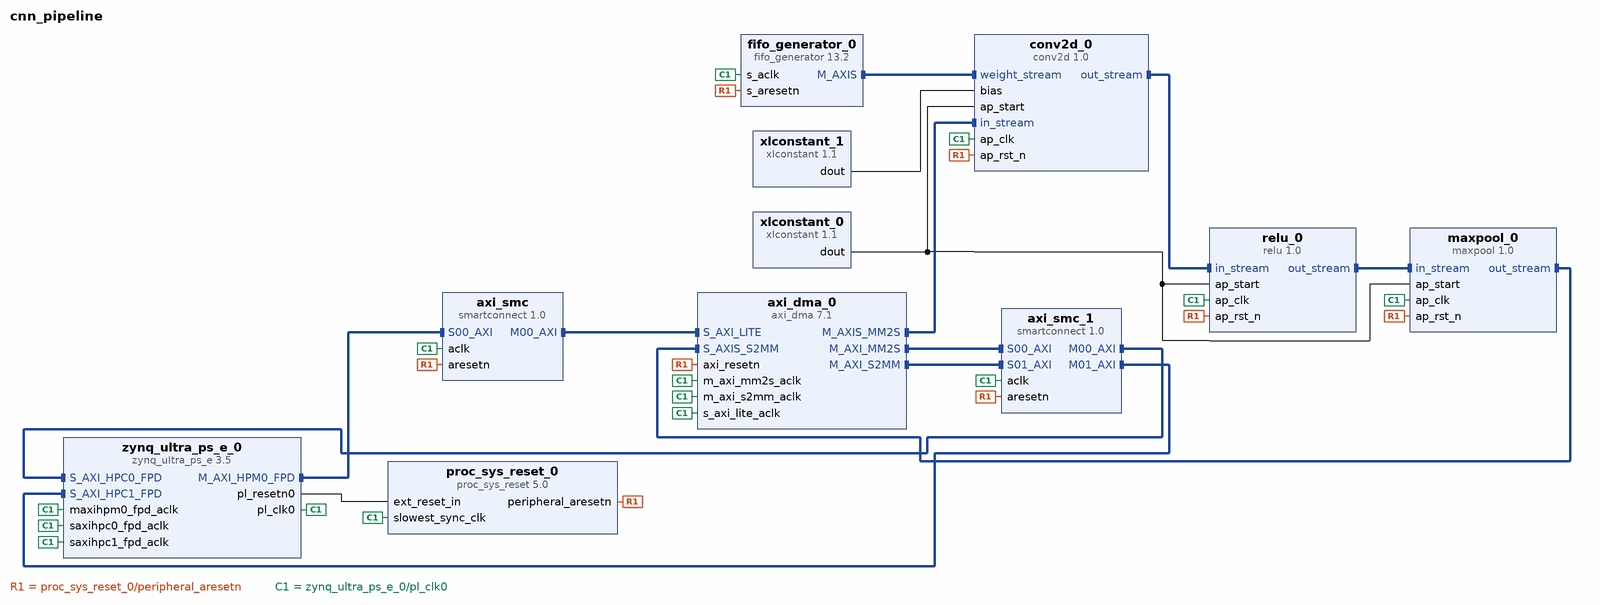
[diagram p0: block diagram of the top level]
# Vivado block design cnn_pipeline, xck26-sfvc784-2LV-c, Vivado 2025.2
create_bd_design cnn_pipeline

create_bd_cell -type ip -vlnv xilinx.com:ip:zynq_ultra_ps_e:3.5 zynq_ultra_ps_e_0
set_property -dict [list \
  CONFIG.PSU_BANK_0_IO_STANDARD LVCMOS18 \
  CONFIG.PSU_BANK_1_IO_STANDARD LVCMOS18 \
  CONFIG.PSU_BANK_2_IO_STANDARD LVCMOS18 \
  CONFIG.PSU_BANK_3_IO_STANDARD LVCMOS18 \
  CONFIG.PSU__CAN1__PERIPHERAL__ENABLE 0 \
  CONFIG.PSU__CRF_APB__ACPU_CTRL__FREQMHZ 1333.333 \
  CONFIG.PSU__CRF_APB__ACPU_CTRL__SRCSEL APLL \
  CONFIG.PSU__CRF_APB__APLL_CTRL__SRCSEL PSS_REF_CLK \
  CONFIG.PSU__CRF_APB__APLL_FRAC_CFG__ENABLED 1 \
  CONFIG.PSU__CRF_APB__DBG_FPD_CTRL__FREQMHZ 250 \
  CONFIG.PSU__CRF_APB__DBG_FPD_CTRL__SRCSEL IOPLL \
  CONFIG.PSU__CRF_APB__DBG_TRACE_CTRL__FREQMHZ 250 \
  CONFIG.PSU__CRF_APB__DBG_TRACE_CTRL__SRCSEL IOPLL \
  CONFIG.PSU__CRF_APB__DBG_TSTMP_CTRL__FREQMHZ 250 \
  CONFIG.PSU__CRF_APB__DBG_TSTMP_CTRL__SRCSEL IOPLL \
  CONFIG.PSU__CRF_APB__DDR_CTRL__FREQMHZ 1200 \
  CONFIG.PSU__CRF_APB__DDR_CTRL__SRCSEL DPLL \
  CONFIG.PSU__CRF_APB__DPDMA_REF_CTRL__FREQMHZ 600 \
  CONFIG.PSU__CRF_APB__DPDMA_REF_CTRL__SRCSEL APLL \
  CONFIG.PSU__CRF_APB__DPLL_CTRL__SRCSEL PSS_REF_CLK \
  CONFIG.PSU__CRF_APB__GDMA_REF_CTRL__FREQMHZ 600 \
  CONFIG.PSU__CRF_APB__GDMA_REF_CTRL__SRCSEL DPLL \
  CONFIG.PSU__CRF_APB__GPU_REF_CTRL__FREQMHZ 600 \
  CONFIG.PSU__CRF_APB__GPU_REF_CTRL__SRCSEL IOPLL \
  CONFIG.PSU__CRF_APB__TOPSW_LSBUS_CTRL__FREQMHZ 100 \
  CONFIG.PSU__CRF_APB__TOPSW_LSBUS_CTRL__SRCSEL IOPLL \
  CONFIG.PSU__CRF_APB__TOPSW_MAIN_CTRL__FREQMHZ 533.33 \
  CONFIG.PSU__CRF_APB__TOPSW_MAIN_CTRL__SRCSEL DPLL \
  CONFIG.PSU__CRF_APB__VPLL_CTRL__SRCSEL PSS_REF_CLK \
  CONFIG.PSU__CRL_APB__ADMA_REF_CTRL__FREQMHZ 500 \
  CONFIG.PSU__CRL_APB__ADMA_REF_CTRL__SRCSEL IOPLL \
  CONFIG.PSU__CRL_APB__CAN1_REF_CTRL__SRCSEL IOPLL \
  CONFIG.PSU__CRL_APB__CPU_R5_CTRL__FREQMHZ 533.333 \
  CONFIG.PSU__CRL_APB__CPU_R5_CTRL__SRCSEL RPLL \
  CONFIG.PSU__CRL_APB__DBG_LPD_CTRL__FREQMHZ 250 \
  CONFIG.PSU__CRL_APB__DBG_LPD_CTRL__SRCSEL IOPLL \
  CONFIG.PSU__CRL_APB__I2C1_REF_CTRL__FREQMHZ 100 \
  CONFIG.PSU__CRL_APB__I2C1_REF_CTRL__SRCSEL IOPLL \
  CONFIG.PSU__CRL_APB__IOPLL_CTRL__SRCSEL PSS_REF_CLK \
  CONFIG.PSU__CRL_APB__IOU_SWITCH_CTRL__FREQMHZ 250 \
  CONFIG.PSU__CRL_APB__IOU_SWITCH_CTRL__SRCSEL IOPLL \
  CONFIG.PSU__CRL_APB__LPD_LSBUS_CTRL__FREQMHZ 100 \
  CONFIG.PSU__CRL_APB__LPD_LSBUS_CTRL__SRCSEL IOPLL \
  CONFIG.PSU__CRL_APB__LPD_SWITCH_CTRL__FREQMHZ 500 \
  CONFIG.PSU__CRL_APB__LPD_SWITCH_CTRL__SRCSEL IOPLL \
  CONFIG.PSU__CRL_APB__PCAP_CTRL__FREQMHZ 200 \
  CONFIG.PSU__CRL_APB__PCAP_CTRL__SRCSEL IOPLL \
  CONFIG.PSU__CRL_APB__PL0_REF_CTRL__FREQMHZ 200 \
  CONFIG.PSU__CRL_APB__PL0_REF_CTRL__SRCSEL IOPLL \
  CONFIG.PSU__CRL_APB__PL1_REF_CTRL__SRCSEL IOPLL \
  CONFIG.PSU__CRL_APB__QSPI_REF_CTRL__FREQMHZ 125 \
  CONFIG.PSU__CRL_APB__QSPI_REF_CTRL__SRCSEL IOPLL \
  CONFIG.PSU__CRL_APB__RPLL_CTRL__SRCSEL PSS_REF_CLK \
  CONFIG.PSU__CRL_APB__SPI1_REF_CTRL__SRCSEL IOPLL \
  CONFIG.PSU__CRL_APB__TIMESTAMP_REF_CTRL__FREQMHZ 100 \
  CONFIG.PSU__CRL_APB__TIMESTAMP_REF_CTRL__SRCSEL IOPLL \
  CONFIG.PSU__CSUPMU__PERIPHERAL__VALID 1 \
  CONFIG.PSU__DDRC__BUS_WIDTH {64 Bit} \
  CONFIG.PSU__DDRC__COMPONENTS Components \
  CONFIG.PSU__DDRC__DEVICE_CAPACITY {8192 MBits} \
  CONFIG.PSU__DDRC__DRAM_WIDTH {16 Bits} \
  CONFIG.PSU__DDRC__ECC Disabled \
  CONFIG.PSU__DDRC__MEMORY_TYPE {DDR 4} \
  CONFIG.PSU__DDRC__SPEED_BIN DDR4_2400R \
  CONFIG.PSU__DDR_HIGH_ADDRESS_GUI_ENABLE 1 \
  CONFIG.PSU__DDR__INTERFACE__FREQMHZ 600.000 \
  CONFIG.PSU__FPGA_PL0_ENABLE 1 \
  CONFIG.PSU__FPGA_PL1_ENABLE 1 \
  CONFIG.PSU__GPIO0_MIO__IO {MIO 0 .. 25} \
  CONFIG.PSU__GPIO0_MIO__PERIPHERAL__ENABLE 1 \
  CONFIG.PSU__GPIO1_MIO__IO {MIO 26 .. 51} \
  CONFIG.PSU__GPIO1_MIO__PERIPHERAL__ENABLE 1 \
  CONFIG.PSU__I2C0__PERIPHERAL__ENABLE 0 \
  CONFIG.PSU__I2C1__PERIPHERAL__ENABLE 1 \
  CONFIG.PSU__I2C1__PERIPHERAL__IO {MIO 24 .. 25} \
  CONFIG.PSU__IOU_SLCR__IOU_TTC_APB_CLK__TTC0_SEL APB \
  CONFIG.PSU__IOU_SLCR__IOU_TTC_APB_CLK__TTC1_SEL APB \
  CONFIG.PSU__IOU_SLCR__IOU_TTC_APB_CLK__TTC2_SEL APB \
  CONFIG.PSU__IOU_SLCR__IOU_TTC_APB_CLK__TTC3_SEL APB \
  CONFIG.PSU__MAXIGP0__DATA_WIDTH 128 \
  CONFIG.PSU__OVERRIDE__BASIC_CLOCK 0 \
  CONFIG.PSU__PMU_COHERENCY 0 \
  CONFIG.PSU__PMU__AIBACK__ENABLE 0 \
  CONFIG.PSU__PMU__EMIO_GPI__ENABLE 0 \
  CONFIG.PSU__PMU__EMIO_GPO__ENABLE 0 \
  CONFIG.PSU__PMU__GPI0__ENABLE 1 \
  CONFIG.PSU__PMU__GPI0__IO {MIO 26} \
  CONFIG.PSU__PMU__GPI1__ENABLE 0 \
  CONFIG.PSU__PMU__GPI2__ENABLE 0 \
  CONFIG.PSU__PMU__GPI3__ENABLE 0 \
  CONFIG.PSU__PMU__GPI4__ENABLE 0 \
  CONFIG.PSU__PMU__GPI5__ENABLE 1 \
  CONFIG.PSU__PMU__GPI5__IO {MIO 31} \
  CONFIG.PSU__PMU__GPO0__ENABLE 0 \
  CONFIG.PSU__PMU__GPO1__ENABLE 0 \
  CONFIG.PSU__PMU__GPO2__ENABLE 0 \
  CONFIG.PSU__PMU__GPO3__ENABLE 1 \
  CONFIG.PSU__PMU__GPO3__IO {MIO 35} \
  CONFIG.PSU__PMU__GPO3__POLARITY low \
  CONFIG.PSU__PMU__GPO4__ENABLE 0 \
  CONFIG.PSU__PMU__GPO5__ENABLE 0 \
  CONFIG.PSU__PMU__PERIPHERAL__ENABLE 1 \
  CONFIG.PSU__PMU__PLERROR__ENABLE 0 \
  CONFIG.PSU__PRESET_APPLIED 1 \
  CONFIG.PSU__PSS_REF_CLK__FREQMHZ 33.333 \
  CONFIG.PSU__QSPI_COHERENCY 0 \
  CONFIG.PSU__QSPI_ROUTE_THROUGH_FPD 0 \
  CONFIG.PSU__QSPI__GRP_FBCLK__ENABLE 0 \
  CONFIG.PSU__QSPI__PERIPHERAL__DATA_MODE x4 \
  CONFIG.PSU__QSPI__PERIPHERAL__ENABLE 1 \
  CONFIG.PSU__QSPI__PERIPHERAL__IO {MIO 0 .. 5} \
  CONFIG.PSU__QSPI__PERIPHERAL__MODE Single \
  CONFIG.PSU__SPI1__GRP_SS0__IO {MIO 9} \
  CONFIG.PSU__SPI1__PERIPHERAL__ENABLE 1 \
  CONFIG.PSU__SPI1__PERIPHERAL__IO {MIO 6 .. 11} \
  CONFIG.PSU__SWDT0__CLOCK__ENABLE 0 \
  CONFIG.PSU__SWDT0__PERIPHERAL__ENABLE 1 \
  CONFIG.PSU__SWDT0__RESET__ENABLE 0 \
  CONFIG.PSU__SWDT1__CLOCK__ENABLE 0 \
  CONFIG.PSU__SWDT1__PERIPHERAL__ENABLE 1 \
  CONFIG.PSU__SWDT1__RESET__ENABLE 0 \
  CONFIG.PSU__TTC0__CLOCK__ENABLE 0 \
  CONFIG.PSU__TTC0__PERIPHERAL__ENABLE 1 \
  CONFIG.PSU__TTC0__WAVEOUT__ENABLE 0 \
  CONFIG.PSU__TTC1__CLOCK__ENABLE 0 \
  CONFIG.PSU__TTC1__PERIPHERAL__ENABLE 1 \
  CONFIG.PSU__TTC1__WAVEOUT__ENABLE 0 \
  CONFIG.PSU__TTC2__CLOCK__ENABLE 0 \
  CONFIG.PSU__TTC2__PERIPHERAL__ENABLE 1 \
  CONFIG.PSU__TTC2__WAVEOUT__ENABLE 0 \
  CONFIG.PSU__TTC3__CLOCK__ENABLE 0 \
  CONFIG.PSU__TTC3__PERIPHERAL__ENABLE 1 \
  CONFIG.PSU__TTC3__WAVEOUT__ENABLE 0 \
  CONFIG.PSU__USE__IRQ0 1 \
  CONFIG.PSU__USE__M_AXI_GP0 1 \
  CONFIG.PSU__USE__M_AXI_GP1 0 \
  CONFIG.PSU__USE__M_AXI_GP2 0 \
  CONFIG.PSU__USE__S_AXI_GP0 1 \
  CONFIG.PSU__USE__S_AXI_GP1 1 \
] [get_bd_cells zynq_ultra_ps_e_0]
# 243 more settings of zynq_ultra_ps_e_0 are not shown: defaults, MIO pin electricals, DDR timing, and values the tool derives
create_bd_cell -type ip -vlnv xilinx.com:ip:proc_sys_reset:5.0 proc_sys_reset_0
create_bd_cell -type ip -vlnv xilinx.com:ip:axi_dma:7.1 axi_dma_0
set_property -dict [list \
  CONFIG.c_include_mm2s_dre 1 \
  CONFIG.c_include_s2mm_dre 1 \
  CONFIG.c_include_sg 0 \
  CONFIG.c_m_axis_mm2s_tdata_width 16 \
  CONFIG.c_sg_length_width 26 \
] [get_bd_cells axi_dma_0]
create_bd_cell -type ip -vlnv xilinx.com:hls:conv2d:1.0 conv2d_0
create_bd_cell -type ip -vlnv xilinx.com:hls:relu:1.0 relu_0
create_bd_cell -type ip -vlnv xilinx.com:hls:maxpool:1.0 maxpool_0
create_bd_cell -type ip -vlnv xilinx.com:ip:smartconnect:1.0 axi_smc
set_property -dict {CONFIG.NUM_SI 1} [get_bd_cells axi_smc]
create_bd_cell -type ip -vlnv xilinx.com:ip:smartconnect:1.0 axi_smc_1
set_property -dict {CONFIG.NUM_MI 2 CONFIG.NUM_SI 2} [get_bd_cells axi_smc_1]
create_bd_cell -type ip -vlnv xilinx.com:ip:fifo_generator:13.2 fifo_generator_0
set_property -dict [list \
  CONFIG.FIFO_Implementation_axis Common_Clock_Block_RAM \
  CONFIG.INTERFACE_TYPE AXI_STREAM \
  CONFIG.Input_Depth_axis 16 \
  CONFIG.TDATA_NUM_BYTES 2 \
] [get_bd_cells fifo_generator_0]
create_bd_cell -type ip -vlnv xilinx.com:ip:xlconstant:1.1 xlconstant_0
create_bd_cell -type ip -vlnv xilinx.com:ip:xlconstant:1.1 xlconstant_1
set_property -dict {CONFIG.CONST_VAL 128 CONFIG.CONST_WIDTH 16} [get_bd_cells xlconstant_1]

# ---- connections ----

connect_bd_intf_net [get_bd_intf_pins axi_dma_0/M_AXIS_MM2S] [get_bd_intf_pins conv2d_0/in_stream]
connect_bd_intf_net [get_bd_intf_pins axi_dma_0/M_AXI_MM2S] [get_bd_intf_pins axi_smc_1/S00_AXI]
connect_bd_intf_net [get_bd_intf_pins axi_dma_0/M_AXI_S2MM] [get_bd_intf_pins axi_smc_1/S01_AXI]
connect_bd_intf_net [get_bd_intf_pins axi_smc_1/M00_AXI] [get_bd_intf_pins zynq_ultra_ps_e_0/S_AXI_HPC0_FPD]
connect_bd_intf_net [get_bd_intf_pins axi_smc_1/M01_AXI] [get_bd_intf_pins zynq_ultra_ps_e_0/S_AXI_HPC1_FPD]
connect_bd_intf_net [get_bd_intf_pins axi_smc/M00_AXI] [get_bd_intf_pins axi_dma_0/S_AXI_LITE]
connect_bd_intf_net [get_bd_intf_pins conv2d_0/out_stream] [get_bd_intf_pins relu_0/in_stream]
connect_bd_intf_net [get_bd_intf_pins conv2d_0/weight_stream] [get_bd_intf_pins fifo_generator_0/M_AXIS]
connect_bd_intf_net [get_bd_intf_pins axi_dma_0/S_AXIS_S2MM] [get_bd_intf_pins maxpool_0/out_stream]
connect_bd_intf_net [get_bd_intf_pins relu_0/out_stream] [get_bd_intf_pins maxpool_0/in_stream]
connect_bd_intf_net [get_bd_intf_pins zynq_ultra_ps_e_0/M_AXI_HPM0_FPD] [get_bd_intf_pins axi_smc/S00_AXI]
connect_bd_net [get_bd_pins proc_sys_reset_0/peripheral_aresetn] \
  [get_bd_pins axi_dma_0/axi_resetn] [get_bd_pins axi_smc/aresetn] [get_bd_pins axi_smc_1/aresetn] \
  [get_bd_pins conv2d_0/ap_rst_n] [get_bd_pins relu_0/ap_rst_n] [get_bd_pins maxpool_0/ap_rst_n] \
  [get_bd_pins fifo_generator_0/s_aresetn]
connect_bd_net [get_bd_pins xlconstant_0/dout] [get_bd_pins conv2d_0/ap_start] [get_bd_pins relu_0/ap_start] [get_bd_pins maxpool_0/ap_start]
connect_bd_net [get_bd_pins xlconstant_1/dout] [get_bd_pins conv2d_0/bias]
connect_bd_net [get_bd_pins zynq_ultra_ps_e_0/pl_clk0] \
  [get_bd_pins zynq_ultra_ps_e_0/maxihpm0_fpd_aclk] [get_bd_pins axi_smc/aclk] [get_bd_pins axi_dma_0/s_axi_lite_aclk] \
  [get_bd_pins proc_sys_reset_0/slowest_sync_clk] [get_bd_pins axi_dma_0/m_axi_mm2s_aclk] [get_bd_pins axi_smc_1/aclk] \
  [get_bd_pins zynq_ultra_ps_e_0/saxihpc0_fpd_aclk] [get_bd_pins zynq_ultra_ps_e_0/saxihpc1_fpd_aclk] \
  [get_bd_pins axi_dma_0/m_axi_s2mm_aclk] [get_bd_pins fifo_generator_0/s_aclk] [get_bd_pins conv2d_0/ap_clk] \
  [get_bd_pins relu_0/ap_clk] [get_bd_pins maxpool_0/ap_clk]
connect_bd_net [get_bd_pins zynq_ultra_ps_e_0/pl_resetn0] [get_bd_pins proc_sys_reset_0/ext_reset_in]

# ---- address map ----
assign_bd_address -offset 0x00000000 -range 2G -target_address_space [get_bd_addr_spaces axi_dma_0/Data_MM2S] [get_bd_addr_segs zynq_ultra_ps_e_0/SAXIGP0/HPC0_DDR_LOW]
assign_bd_address -offset 0xC0000000 -range 512M -target_address_space [get_bd_addr_spaces axi_dma_0/Data_MM2S] [get_bd_addr_segs zynq_ultra_ps_e_0/SAXIGP0/HPC0_QSPI]
exclude_bd_addr_seg -offset 0x00000000 -range 1 -target_address_space [get_bd_addr_spaces axi_dma_0/Data_MM2S] [get_bd_addr_segs zynq_ultra_ps_e_0/SAXIGP0/HPC0_DDR_HIGH]
exclude_bd_addr_seg -offset 0x00000000 -range 1 -target_address_space [get_bd_addr_spaces axi_dma_0/Data_MM2S] [get_bd_addr_segs zynq_ultra_ps_e_0/SAXIGP1/HPC1_DDR_HIGH]
exclude_bd_addr_seg -offset 0x00000000 -range 1 -target_address_space [get_bd_addr_spaces axi_dma_0/Data_MM2S] [get_bd_addr_segs zynq_ultra_ps_e_0/SAXIGP1/HPC1_DDR_LOW]
exclude_bd_addr_seg -offset 0x00000000 -range 1 -target_address_space [get_bd_addr_spaces axi_dma_0/Data_MM2S] [get_bd_addr_segs zynq_ultra_ps_e_0/SAXIGP1/HPC1_QSPI]
exclude_bd_addr_seg -offset 0xFF000000 -range 16M -target_address_space [get_bd_addr_spaces axi_dma_0/Data_MM2S] [get_bd_addr_segs zynq_ultra_ps_e_0/SAXIGP0/HPC0_LPS_OCM]
exclude_bd_addr_seg -offset 0xFF000000 -range 16M -target_address_space [get_bd_addr_spaces axi_dma_0/Data_MM2S] [get_bd_addr_segs zynq_ultra_ps_e_0/SAXIGP1/HPC1_LPS_OCM]
assign_bd_address -offset 0x00000000 -range 1G -target_address_space [get_bd_addr_spaces axi_dma_0/Data_S2MM] [get_bd_addr_segs zynq_ultra_ps_e_0/SAXIGP0/HPC0_DDR_LOW]
assign_bd_address -offset 0x40000000 -range 1G -target_address_space [get_bd_addr_spaces axi_dma_0/Data_S2MM] [get_bd_addr_segs zynq_ultra_ps_e_0/SAXIGP1/HPC1_DDR_LOW]
assign_bd_address -offset 0xC0000000 -range 256M -target_address_space [get_bd_addr_spaces axi_dma_0/Data_S2MM] [get_bd_addr_segs zynq_ultra_ps_e_0/SAXIGP0/HPC0_QSPI]
assign_bd_address -offset 0xD0000000 -range 256M -target_address_space [get_bd_addr_spaces axi_dma_0/Data_S2MM] [get_bd_addr_segs zynq_ultra_ps_e_0/SAXIGP1/HPC1_QSPI]
exclude_bd_addr_seg -offset 0x00000000 -range 1 -target_address_space [get_bd_addr_spaces axi_dma_0/Data_S2MM] [get_bd_addr_segs zynq_ultra_ps_e_0/SAXIGP0/HPC0_DDR_HIGH]
exclude_bd_addr_seg -offset 0x00000000 -range 1 -target_address_space [get_bd_addr_spaces axi_dma_0/Data_S2MM] [get_bd_addr_segs zynq_ultra_ps_e_0/SAXIGP1/HPC1_DDR_HIGH]
exclude_bd_addr_seg -offset 0xFF000000 -range 8M -target_address_space [get_bd_addr_spaces axi_dma_0/Data_S2MM] [get_bd_addr_segs zynq_ultra_ps_e_0/SAXIGP0/HPC0_LPS_OCM]
exclude_bd_addr_seg -offset 0xFF800000 -range 8M -target_address_space [get_bd_addr_spaces axi_dma_0/Data_S2MM] [get_bd_addr_segs zynq_ultra_ps_e_0/SAXIGP1/HPC1_LPS_OCM]
assign_bd_address -offset 0x00A0000000 -range 64K -target_address_space [get_bd_addr_spaces zynq_ultra_ps_e_0/Data] [get_bd_addr_segs axi_dma_0/S_AXI_LITE/Reg]

validate_bd_design
save_bd_design
